# Altium schematic sheet Main.SchDoc
size A; SheetNumber: 1
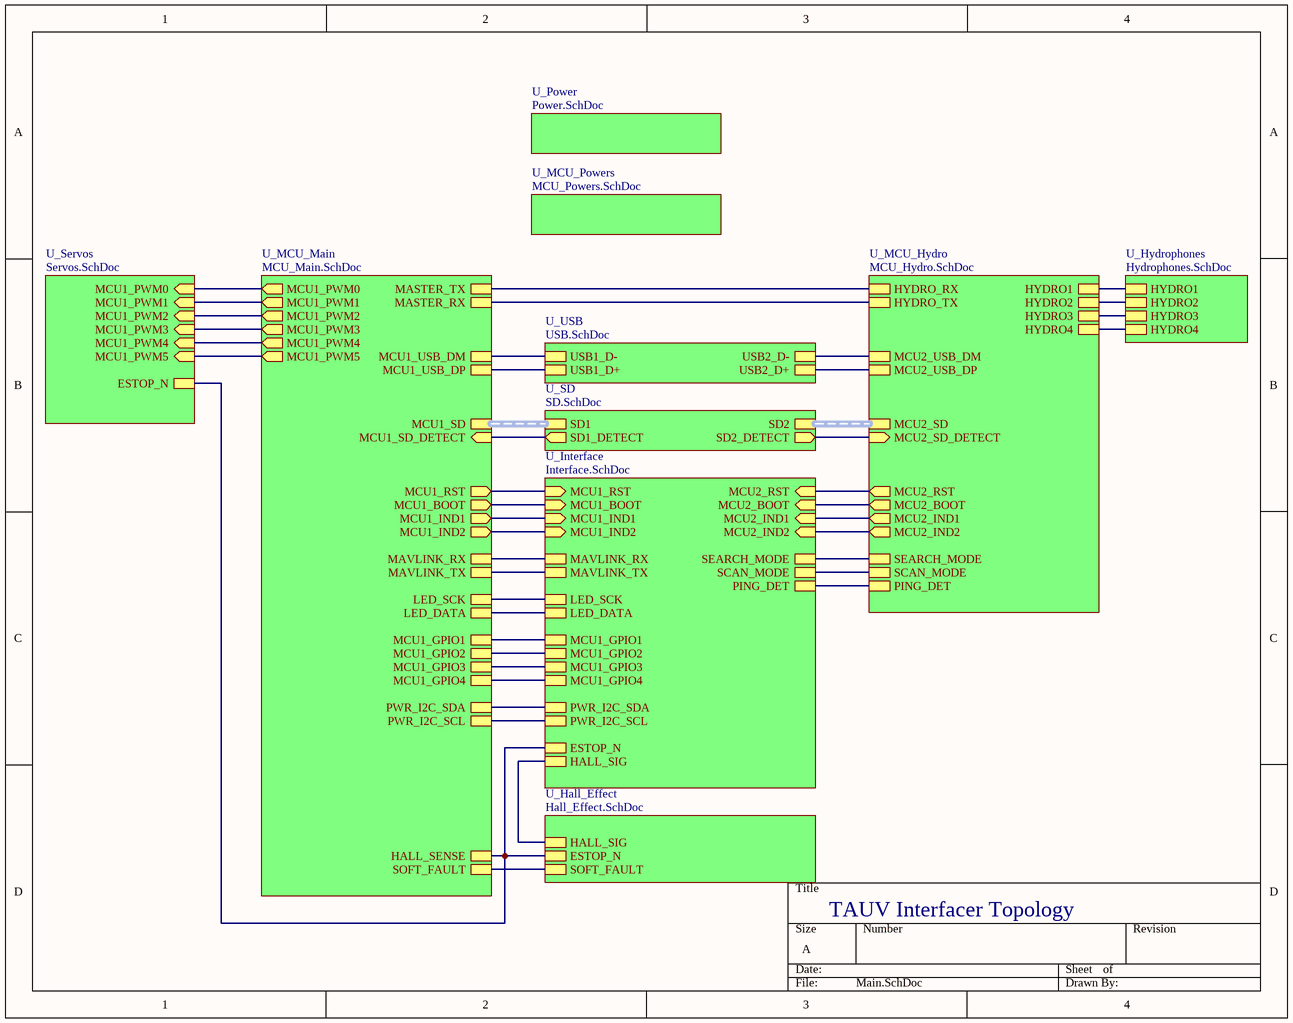
[diagram p0: Main.SchDoc]

## Sub-sheets
U_Hall_Effect = Hall_Effect.SchDoc: ESTOP_N, HALL_SIG, SOFT_FAULT
U_Hydrophones = Hydrophones.SchDoc: HYDRO1, HYDRO2, HYDRO3, HYDRO4
U_Interface = Interface.SchDoc: MCU1_BOOT (in), MAVLINK_RX, MAVLINK_TX, LED_SCK, LED_DATA, MCU1_GPIO1, MCU1_GPIO2, MCU1_GPIO3, MCU1_GPIO4, PWR_I2C_SDA, PWR_I2C_SCL, ESTOP_N, HALL_SIG, MCU1_RST (in), MCU1_IND1 (in), MCU1_IND2 (in), MCU2_RST (in), MCU2_BOOT (in), MCU2_IND1 (in), MCU2_IND2 (in), SEARCH_MODE, SCAN_MODE, PING_DET
U_MCU_Hydro = MCU_Hydro.SchDoc: MCU2_BOOT (out), MCU2_USB_DM, MCU2_USB_DP, MCU2_SD (harness SDIO), HYDRO_TX, HYDRO_RX, HYDRO1, HYDRO2, HYDRO3, HYDRO4, MCU2_SD_DETECT (in), MCU2_IND2 (out), SEARCH_MODE, MCU2_IND1 (out), MCU2_RST (out), SCAN_MODE, PING_DET
U_MCU_Main = MCU_Main.SchDoc: MCU1_BOOT (out), MCU1_USB_DM, MCU1_USB_DP, MCU1_SD (harness SDIO), LED_SCK, LED_DATA, MAVLINK_TX, MAVLINK_RX, MASTER_TX, MASTER_RX, MCU1_SD_DETECT (in), MCU1_PWM1 (out), MCU1_PWM2 (out), MCU1_PWM3 (out), MCU1_PWM4 (out), MCU1_PWM5 (out), MCU1_GPIO1, MCU1_GPIO2, MCU1_IND2 (out), MCU1_PWM0 (out), MCU1_IND1 (out), MCU1_GPIO3, MCU1_GPIO4, PWR_I2C_SDA, PWR_I2C_SCL, HALL_SENSE, MCU1_RST (out), SOFT_FAULT
U_MCU_Powers = MCU_Powers.SchDoc: no entries
U_Power = Power.SchDoc: no entries
U_SD = SD.SchDoc: SD1 (harness SDIO), SD1_DETECT (out), SD2 (harness SDIO), SD2_DETECT (out)
U_Servos = Servos.SchDoc: MCU1_PWM1 (in), MCU1_PWM2 (in), MCU1_PWM3 (in), MCU1_PWM4 (in), MCU1_PWM5 (in), MCU1_PWM0 (in), ESTOP_N
U_USB = USB.SchDoc: USB1_D-, USB1_D+, USB2_D-, USB2_D+

## Nets
(unnamed): sheet U_Hydrophones/HYDRO1, sheet U_MCU_Hydro/HYDRO1
(unnamed): sheet U_Hydrophones/HYDRO2, sheet U_MCU_Hydro/HYDRO2
(unnamed): sheet U_Hydrophones/HYDRO3, sheet U_MCU_Hydro/HYDRO3
(unnamed): sheet U_Hydrophones/HYDRO4, sheet U_MCU_Hydro/HYDRO4
(unnamed): sheet U_MCU_Hydro/MCU2_BOOT, sheet U_Interface/MCU2_BOOT
(unnamed): sheet U_MCU_Hydro/MCU2_USB_DM, sheet U_USB/USB2_D-
(unnamed): sheet U_MCU_Hydro/MCU2_USB_DP, sheet U_USB/USB2_D+
(unnamed): sheet U_MCU_Hydro/HYDRO_TX, sheet U_MCU_Main/MASTER_RX
(unnamed): sheet U_MCU_Hydro/HYDRO_RX, sheet U_MCU_Main/MASTER_TX
(unnamed): sheet U_MCU_Hydro/MCU2_SD_DETECT, sheet U_SD/SD2_DETECT
(unnamed): sheet U_MCU_Hydro/MCU2_IND2, sheet U_Interface/MCU2_IND2
(unnamed): sheet U_MCU_Hydro/SEARCH_MODE, sheet U_Interface/SEARCH_MODE
(unnamed): sheet U_MCU_Hydro/MCU2_IND1, sheet U_Interface/MCU2_IND1
(unnamed): sheet U_MCU_Hydro/MCU2_RST, sheet U_Interface/MCU2_RST
(unnamed): sheet U_MCU_Hydro/SCAN_MODE, sheet U_Interface/SCAN_MODE
(unnamed): sheet U_MCU_Hydro/PING_DET, sheet U_Interface/PING_DET
(unnamed): sheet U_MCU_Main/MCU1_BOOT, sheet U_Interface/MCU1_BOOT
(unnamed): sheet U_MCU_Main/MCU1_USB_DM, sheet U_USB/USB1_D-
(unnamed): sheet U_MCU_Main/MCU1_USB_DP, sheet U_USB/USB1_D+
(unnamed): sheet U_MCU_Main/LED_SCK, sheet U_Interface/LED_SCK
(unnamed): sheet U_MCU_Main/LED_DATA, sheet U_Interface/LED_DATA
(unnamed): sheet U_MCU_Main/MAVLINK_TX, sheet U_Interface/MAVLINK_TX
(unnamed): sheet U_MCU_Main/MAVLINK_RX, sheet U_Interface/MAVLINK_RX
(unnamed): sheet U_MCU_Main/MCU1_SD_DETECT, sheet U_SD/SD1_DETECT
(unnamed): sheet U_MCU_Main/MCU1_PWM1, sheet U_Servos/MCU1_PWM1
(unnamed): sheet U_MCU_Main/MCU1_PWM2, sheet U_Servos/MCU1_PWM2
(unnamed): sheet U_MCU_Main/MCU1_PWM3, sheet U_Servos/MCU1_PWM3
(unnamed): sheet U_MCU_Main/MCU1_PWM4, sheet U_Servos/MCU1_PWM4
(unnamed): sheet U_MCU_Main/MCU1_PWM5, sheet U_Servos/MCU1_PWM5
(unnamed): sheet U_MCU_Main/MCU1_GPIO1, sheet U_Interface/MCU1_GPIO1
(unnamed): sheet U_MCU_Main/MCU1_GPIO2, sheet U_Interface/MCU1_GPIO2
(unnamed): sheet U_MCU_Main/MCU1_IND2, sheet U_Interface/MCU1_IND2
(unnamed): sheet U_MCU_Main/MCU1_PWM0, sheet U_Servos/MCU1_PWM0
(unnamed): sheet U_MCU_Main/MCU1_IND1, sheet U_Interface/MCU1_IND1
(unnamed): sheet U_MCU_Main/MCU1_GPIO3, sheet U_Interface/MCU1_GPIO3
(unnamed): sheet U_MCU_Main/MCU1_GPIO4, sheet U_Interface/MCU1_GPIO4
(unnamed): sheet U_MCU_Main/PWR_I2C_SDA, sheet U_Interface/PWR_I2C_SDA
(unnamed): sheet U_MCU_Main/PWR_I2C_SCL, sheet U_Interface/PWR_I2C_SCL
(unnamed): sheet U_MCU_Main/HALL_SENSE, sheet U_Servos/ESTOP_N, sheet U_Interface/ESTOP_N, sheet U_Hall_Effect/ESTOP_N
(unnamed): sheet U_MCU_Main/MCU1_RST, sheet U_Interface/MCU1_RST
(unnamed): sheet U_MCU_Main/SOFT_FAULT, sheet U_Hall_Effect/SOFT_FAULT
(unnamed): sheet U_Interface/HALL_SIG, sheet U_Hall_Effect/HALL_SIG

## Buses and harness runs
harness sheet U_MCU_Hydro/MCU2_SD = sheet U_SD/SD2
harness sheet U_MCU_Main/MCU1_SD = sheet U_SD/SD1

## Notes on the sheet
- TAUV Interfacer Topology